# Altium project Yukitora.PrjPcb (part 3 of 5)

## Sheet Levels.SchDoc
size Tabloid
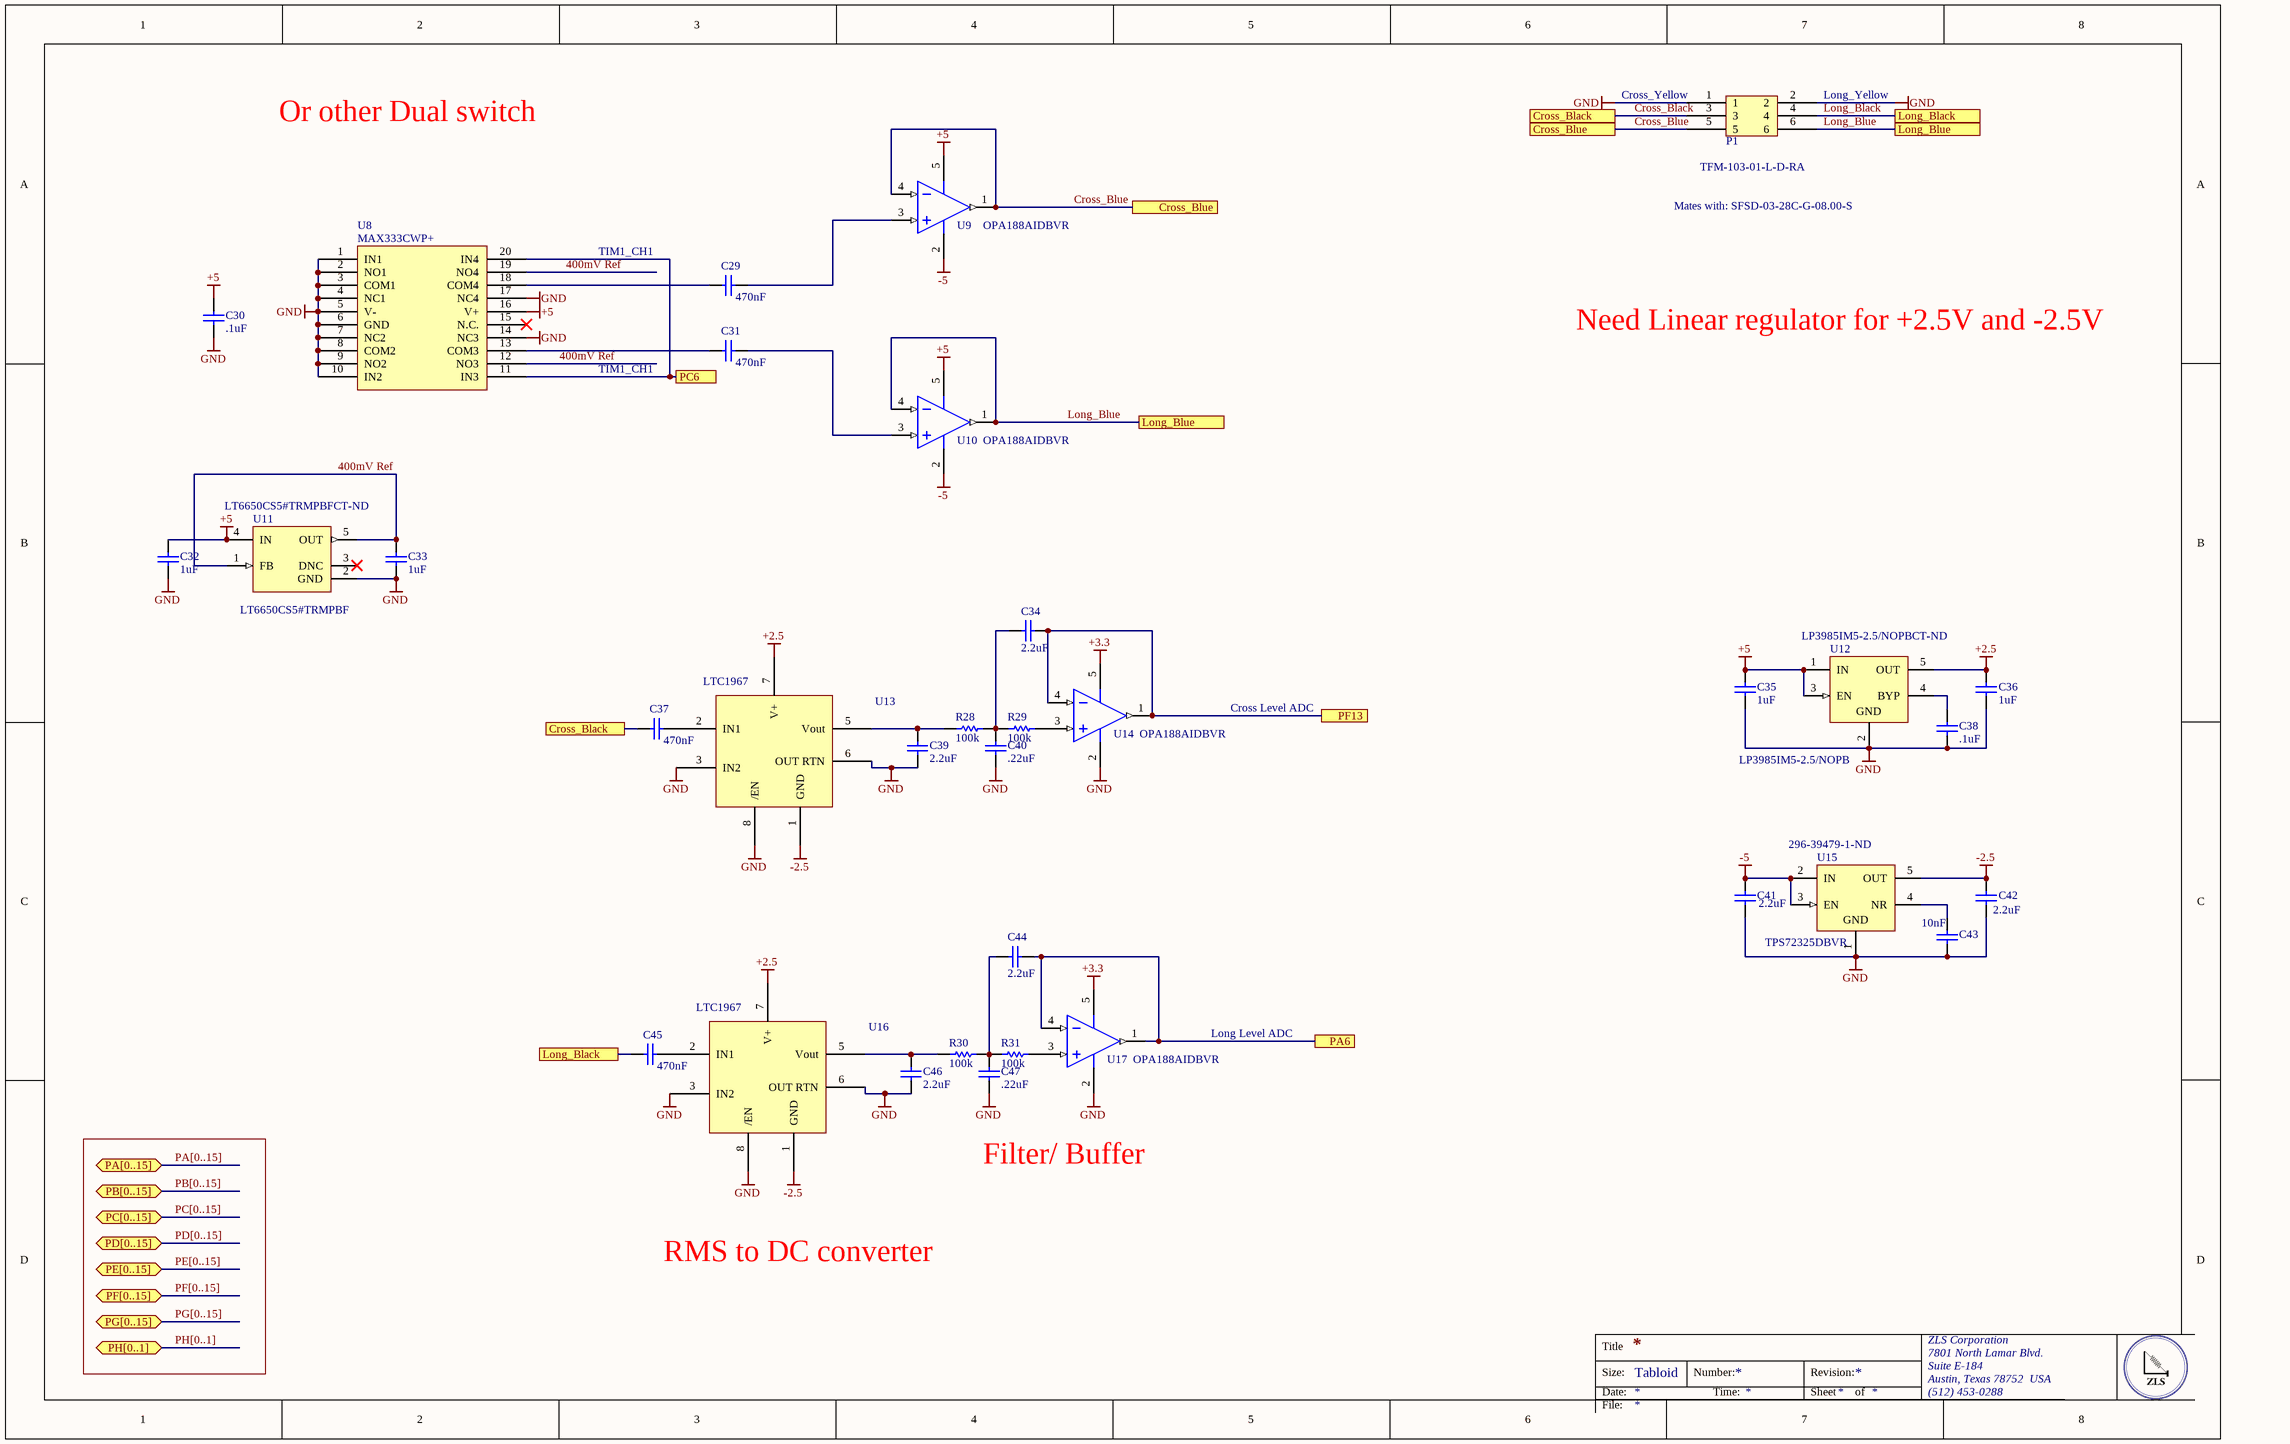
[diagram p6: Levels.SchDoc]

### Parts
C29  470nF  [CAPC0805(2012)75_L]
C30  .1uF  [CAPC0805(2012)75_L]
C31  470nF  [CAPC0805(2012)75_L]
C32  Capacitance: 1uF  [CAPC0805(2012)145_N]  (hidden comment: 08053C105JAT2A)
C33  Capacitance: 1uF  [CAPC0805(2012)145_N]  (hidden comment: 08053C105JAT2A)
C34  2.2uF  [CAPC0805(2012)75_L]
C35  Capacitance: 1uF  [CAPC0805(2012)145_N]  (hidden comment: 08053C105JAT2A)
C36  Capacitance: 1uF  [CAPC0805(2012)145_N]  (hidden comment: 08053C105JAT2A)
C37  470nF  [CAPC0805(2012)75_L]
C38  .1uF  [CAPC0805(2012)75_L]
C39  2.2uF  [CAPC0805(2012)75_L]
C40  .22uF  [CAPC0805(2012)75_L]
C41  Capacitance: 2.2uF  [CAPC2013X135X50ML10T20]  (hidden comment: GRM21BR71A225KA01L)
C42  Capacitance: 2.2uF  [CAPC2013X135X50ML10T20]  (hidden comment: GRM21BR71A225KA01L)
C43  Capacitance: 10nF  [CAPC2013X140X50NL20T25]  (hidden comment: 0805ZC103KAT2A)
C44  2.2uF  [CAPC0805(2012)75_L]
C45  470nF  [CAPC0805(2012)75_L]
C46  2.2uF  [CAPC0805(2012)75_L]
C47  .22uF  [CAPC0805(2012)75_L]
P1  TFM-103-01-L-D-RA  [TFM-103-01-L-D-RA]
R28  100k  [RESC0805(2012)_L]
R29  100k  [RESC0805(2012)_L]
R30  100k  [RESC0805(2012)_L]
R31  100k  [RESC0805(2012)_L]
U8  MAX333CWP+  [TSOP65P640X90-20N]
U9  OPA188AIDBVR  [DBV0005A_M]
U10  OPA188AIDBVR  [DBV0005A_M]
U11  LT6650CS5#TRMPBF  Supplier Part Number 1: LT6650CS5#TRMPBFCT-ND  [LT-S5-5-TSOT-23_N]
U12  LP3985IM5-2.5/NOPB  Supplier Part Number 1: LP3985IM5-2.5/NOPBCT-ND  [DBV0005A_M]
U13  LTC1967  [LTC1967]
U14  OPA188AIDBVR  [DBV0005A_M]
U15  TPS72325DBVR  Supplier Part Number 1: 296-39479-1-ND  [DBV0005A_N]
U16  LTC1967  [LTC1967]
U17  OPA188AIDBVR  [DBV0005A_M]

### Ports
Cross_Black, Cross_Blue, Long_Black, Long_Blue, PA6, PA[0..15] (bidir), PB[0..15] (bidir), PC6, PC[0..15] (bidir), PD[0..15] (bidir), PE[0..15] (bidir), PF13, PF[0..15] (bidir), PG[0..15] (bidir), PH[0..1] (bidir)

### Nets
+2.5: C36.2 U12.5(OUT) U13.7(V+) U16.7(V+)
+3.3: U14.5(V+) U17.5(V+)
+5: C30.2 C32.2 C35.2 U8.16(V+) U9.5(V+) U10.5(V+) U11.4(IN) U12.1(IN) U12.3(EN)
-2.5: C42.2 U13.1(GND) U15.5(OUT) U16.1(GND)
-5: C41.2 U9.2(V-) U10.2(V-) U15.2(IN) U15.3(EN)
GND: C30.1 C32.1 C33.1 C35.1 C36.1 C38.1 C39.1 C40.1 C41.1 C42.1 C43.1 C46.1 C47.1 P1.1 P1.2 U8.1(IN1) U8.2(NO1) U8.3(COM1) U8.4(NC1) U8.5(V-) U8.6(GND) U8.7(NC2) U8.8(COM2) U8.9(NO2) U8.10(IN2) U8.14(NC3) U8.17(NC4) U11.2(GND) U12.2(GND) U13.3(IN2) U13.6(OUT_RTN) U13.8(/EN) U14.2(V-) U15.1(GND) U16.3(IN2) U16.6(OUT_RTN) U16.8(/EN) U17.2(V-)
400mV Ref: C33.2 U8.12(NO3) U8.19(NO4) U11.1(FB) U11.5(OUT)
Cross_Black: C37.1 P1.3 ; port Cross_Black
Cross_Blue: P1.5 U9.1(OUT) U9.4(IN-) ; port Cross_Blue
Long_Black: C45.1 P1.4 ; port Long_Black
Long_Blue: P1.6 U10.1(OUT) U10.4(IN-) ; port Long_Blue
PA6: C44.1 U17.1(OUT) U17.4(IN-) ; port PA6
PC6: U8.11(IN3) U8.20(IN4) ; port PC6
PF13: C34.1 U14.1(OUT) U14.4(IN-) ; port PF13
NetC29_1: C29.1 U8.18(COM4)
NetC29_2: C29.2 U9.3(IN+)
NetC31_1: C31.1 U8.13(COM3)
NetC31_2: C31.2 U10.3(IN+)
NetC34_2: C34.2 C40.2 R28.1 R29.2
NetC37_2: C37.2 U13.2(IN1)
NetC38_2: C38.2 U12.4(BYP)
NetC39_2: C39.2 R28.2 U13.5(Vout)
NetC43_2: C43.2 U15.4(NR)
NetC44_2: C44.2 C47.2 R30.1 R31.2
NetC45_2: C45.2 U16.2(IN1)
NetC46_2: C46.2 R30.2 U16.5(Vout)
NetR29_1: R29.1 U14.3(IN+)
NetR31_1: R31.1 U17.3(IN+)

Not connected (* = marked no-connect by the designer): U8 15(N.C.)*; U11 3(DNC)*; U13 4(NC); U16 4(NC)

### Buses and harness runs
bus PA[0..15] = port PA[0..15]
bus PB[0..15] = port PB[0..15]
bus PC[0..15] = port PC[0..15]
bus PD[0..15] = port PD[0..15]
bus PE[0..15] = port PE[0..15]
bus PF[0..15] = port PF[0..15]
bus PG[0..15] = port PG[0..15]
bus PH[0..1] = port PH[0..1]

### Notes on the sheet
- Or other Dual switch
- (near P1) Cross_Yellow
- (near P1) Long_Yellow
- Mates with: SFSD-03-28C-G-08.00-S
- TIM1_CH1
- Need Linear regulator for +2.5V and -2.5V
- Cross Level ADC
- Long Level ADC
- Filter/ Buffer
- RMS to DC converter
- Title
- Size:
- Date:
- Tabloid
- Number:
- Time:
- Revision:
- Sheet
- of
- ZLS Corporation
- 7801 North Lamar Blvd.
- Suite E-184
- Austin, Texas 78752  USA
- (512) 453-0288
- File:

### Library data of the parts
C29 C31 C37 C45 = CMP-1036-02117-1: CAP 150pF 16V ±10% 0805 (2012 Metric) Thickness 0.75mm SMD; Case-EIA: 0805; Tolerance: Â±10%; Value: .47uF; Case-Metric: 2012; Technology: SMT; Max Thickness: 0.75 mm; Rated Voltage: 16 V
C30 = CMP-1036-02117-1: CAP 150pF 16V ±10% 0805 (2012 Metric) Thickness 0.75mm SMD; Case-EIA: 0805; Tolerance: Â±10%; Case-Metric: 2012; Technology: SMT; Max Thickness: 0.75 mm; Rated Voltage: 16 V; Value: .1uF
C32 C33 C35 C36 = CMP-1036-04752-1: 1µF ±5% 25V Ceramic Capacitor X7R 0805 (2012 Metric); Manufacturer: Kyocera AVX; Tolerance: Â±5%; Case-Metric: 2012; Case-EIA: 0805; Value: 1uF; Technology: SMT; Rated Voltage: 25 V; Max Thickness: 1.45 mm; Supplier 1: Digi-Key; Supplier Part Number 1: 478-10487-1-ND; Manufacturer Part Number: 08053C105JAT2A; Stock 1: 13701; Pricing 1: 1=0.44000, 10=0.30400, 100=0.18220, 500=0.13662, 1000=0.11537 (USD); RoHS: Yes; Mount: Surface Mount; Case/Package: 0805; Number of Pins: 2; Case Code (Metric): 2012; Case Code (Imperial): 0805; Contact Plating: Tin; Min Operating Temperature: -55°C; Max Operating Temperature: 125°C; Packaging: Tape and Reel; Voltage Rating: 25V; Package Quantity: 2000; Dielectric: X7R; Voltage Rating (DC): 25V; Termination: SMD/SMT; Length: 2.01mm; Height: 1.4mm; Width: 0.049inch; Thickness: 0.037inch; Depth: 1.25mm; Radiation Hardening: No; Lead Free: Lead Free; REACH SVHC: Unknown; ComponentLink1URL: https://datasheet.ciiva.com/221/cx7r-221690.pdf?src-supplier=Digi-Key; ComponentLink1Description: https://datasheet.ciiva.com/221/cx7r-221690.pdf?src-supplier=Digi-Key; ComponentLink2URL: https://datasheet.ciiva.com/5419/cx7r-218113-5419770.pdf?src-supplier=Mouser; ComponentLink2Description: https://datasheet.ciiva.com/5419/cx7r-218113-5419770.pdf?src-supplier=Mouser; ComponentLink3URL: https://datasheet.ciiva.com/28586/1679506-28586091.pdf?src-supplier=Element14; ComponentLink3Description: https://datasheet.ciiva.com/28586/1679506-28586091.pdf?src-supplier=Element14; ComponentLink4URL: https://datasheet.ciiva.com/11499/cx7r-11499836.pdf?src-supplier=Avnet; ComponentLink4Description: https://datasheet.ciiva.com/11499/cx7r-11499836.pdf?src-supplier=Avnet
C34 C39 C40 C44 C46 C47 = CMP-1036-02117-1: CAP 150pF 16V ±10% 0805 (2012 Metric) Thickness 0.75mm SMD; Case-EIA: 0805; Tolerance: Â±10%; Value: 1uF; Case-Metric: 2012; Technology: SMT; Max Thickness: 0.75 mm; Rated Voltage: 16 V
C38 = CMP-1036-02117-1: 0.1µF ±10% 25V Ceramic Capacitor X7R 0805 (2012 Metric); Manufacturer: Vishay; Manufacturer Part Number: VJ0805Y104KXXCW1BC; Dielectric Material: Tantalum; Capacitance: 100nF; Supplier 1: Digi-Key; Supplier Part Number 1: 720-1537-1-ND; Stock 1: 72674; Pricing 1: 1=0.26000, 10=0.17900, 100=0.10120, 500=0.07142, 1000=0.06250 (USD); RoHS: Yes; Mount: Surface Mount; Case/Package: 0805; Number of Pins: 2; Weight: 0.000194oz; Case Code (Imperial): 0805; Case Code (Metric): 2012; Min Operating Temperature: -55°C; Max Operating Temperature: 125°C; Tolerance: 10%; Packaging: Tape and Reel; Package Quantity: 4000; Voltage Rating: 25V; Dielectric: X7R; Voltage Rating (DC): 25V; Termination: SMD/SMT; Length: 2mm; Height: 1.45mm; Width: 1.25mm; Thickness: 0.037inch; Depth: 1.25mm; Lead Free: Lead Free; ComponentLink1URL: https://datasheet.ciiva.com/11491/vjw1bcbascomseries-11491758.pdf?src-supplier=Avnet; ComponentLink1Description: https://datasheet.ciiva.com/11491/vjw1bcbascomseries-11491758.pdf?src-supplier=Avnet; ComponentLink2URL: https://datasheet.ciiva.com/176/vjw1bcbascomseries-176875.pdf?src-supplier=Digi-Key; ComponentLink2Description: https://datasheet.ciiva.com/176/vjw1bcbascomseries-176875.pdf?src-supplier=Digi-Key
C41 C42 = CMP-2007-03454-1: 2.2µF ±10% 10V Ceramic Capacitor X7R 0805 (2012 Metric); Manufacturer: Murata; Dissipation Factor: 0.035%; Part Number: GRM21BR71A225KA01L; Supplier 1: Digi-Key; Supplier Part Number 1: 490-1696-1-ND; Manufacturer Part Number: GRM21BR71A225KA01L; Stock 1: 271684; Pricing 1: 1=0.27000, 10=0.18600, 100=0.09440, 500=0.06458, 1000=0.05713 (USD); RoHS: Yes; Mount: Surface Mount; Case/Package: 0805; Number of Pins: 2; Case Code (Imperial): 0805; Case Code (Metric): 2012; Min Operating Temperature: -55°C; Max Operating Temperature: 125°C; Tolerance: 10%; Packaging: Tape and Reel; Package Quantity: 1; Voltage Rating: 10V; Dielectric: X7R; Voltage Rating (DC): 10V; Termination: SMD/SMT; Voltage: 10V; Length: 2mm; Height: 1.25mm; Width: 1.25mm; Thickness: 0.053inch; Depth: 1.25mm; Radiation Hardening: No; REACH SVHC: No SVHC; Lead Free: Lead Free; ComponentLink1URL: https://datasheet.ciiva.com/2989/product-2989712.pdf?src-supplier=Avnet; ComponentLink1Description: https://datasheet.ciiva.com/2989/product-2989712.pdf?src-supplier=Avnet; ComponentLink2URL: https://datasheet.ciiva.com/3778/grm21br71a225ka0123-3778504.pdf?src-supplier=Arrow; ComponentLink2Description: https://datasheet.ciiva.com/3778/grm21br71a225ka0123-3778504.pdf?src-supplier=Arrow; ComponentLink3URL: https://datasheet.ciiva.com/11786/0900766b80936815-11786251.pdf?src-supplier=RSComponents; ComponentLink3Description: https://datasheet.ciiva.com/11786/0900766b80936815-11786251.pdf?src-supplier=RSComponents; ComponentLink4URL: https://datasheet.ciiva.com/16203/product-16203815.pdf?src-supplier=Future+Electronics; ComponentLink4Description: https://datasheet.ciiva.com/16203/product-16203815.pdf?src-supplier=Future+Electronics; ComponentLink5URL: https://datasheet.ciiva.com/135/partnumbering-e-01-135064.pdf?src-supplier=Digi-Key; ComponentLink5Description: https://datasheet.ciiva.com/135/partnumbering-e-01-135064.pdf?src-supplier=Digi-Key; ComponentLink6URL: https://datasheet.ciiva.com/135/partnumbering-e-01-135065.pdf?src-supplier=Digi-Key; ComponentLink6Description: https://datasheet.ciiva.com/135/partnumbering-e-01-135065.pdf?src-supplier=Digi-Key; ComponentLink7URL: https://datasheet.ciiva.com/135/partnumbering-e-01-135066.pdf?src-supplier=Digi-Key; ComponentLink7Description: https://datasheet.ciiva.com/135/partnumbering-e-01-135066.pdf?src-supplier=Digi-Key; ComponentLink8URL: https://datasheet.ciiva.com/22703/608985-22703358.pdf?src-supplier=Element14; ComponentLink8Description: https://datasheet.ciiva.com/22703/608985-22703358.pdf?src-supplier=Element14; ComponentLink9URL: https://datasheet.ciiva.com/2989/product-2989711.pdf?src-supplier=Avnet; ComponentLink9Description: https://datasheet.ciiva.com/2989/product-2989711.pdf?src-supplier=Avnet
C43 = CMP-2007-04770-1: 10000pF ±10% 10V Ceramic Capacitor X7R 0805 (2012 Metric); Manufacturer: AVX Interconnect / Elco; Part Number: 0805ZC103KAT2A; Supplier 1: Digi-Key; Supplier Part Number 1: 478-11396-1-ND; Manufacturer Part Number: 0805ZC103KAT2A; Stock 1: 11980; Pricing 1: 1=0.32000, 10=0.21700, 100=0.11010, 500=0.07534, 1000=0.06665 (USD); RoHS: Yes; Mount: Surface Mount; Case/Package: 0805; Number of Pins: 2; Case Code (Metric): 2012; Case Code (Imperial): 0805; Min Operating Temperature: -55°C; Max Operating Temperature: 125°C; Tolerance: 10%; Packaging: Tape and Reel; Termination: SMD/SMT; Package Quantity: 4000; Dielectric: X7R; Voltage Rating (DC): 10V; Voltage Rating: 10V; Length: 2.01mm; Width: 0.049inch; Depth: 1.25mm; Thickness: 0.037inch; Radiation Hardening: No; REACH SVHC: Unknown; ComponentLink1URL: https://datasheet.ciiva.com/205/cx7r-205251.pdf?src-supplier=Digi-Key; ComponentLink1Description: https://datasheet.ciiva.com/205/cx7r-205251.pdf?src-supplier=Digi-Key; ComponentLink2URL: https://datasheet.ciiva.com/11508/cx7r-11508056.pdf?src-supplier=Avnet; ComponentLink2Description: https://datasheet.ciiva.com/11508/cx7r-11508056.pdf?src-supplier=Avnet; ComponentLink3URL: https://datasheet.ciiva.com/17489/cx7r-17489036.pdf?src-supplier=Avnet+Europe; ComponentLink3Description: https://datasheet.ciiva.com/17489/cx7r-17489036.pdf?src-supplier=Avnet+Europe; ComponentLink4URL: https://datasheet.ciiva.com/5420/cx7r-5420079.pdf?src-supplier=Mouser; ComponentLink4Description: https://datasheet.ciiva.com/5420/cx7r-5420079.pdf?src-supplier=Mouser
P1 = TFM-103-01-L-D-RA: Manufacturer: Samtec; System: Connector; Supplier 1: Mouser; Supplier Part Number 1: 200-TFM10301LDRA; Manufacturer Part Number: TFM-103-01-L-D-RA; Stock 1: 202; Pricing 1: 1=2.15000, 10=1.78000, 50=1.78000, 100=1.33000, 1000=0.98500, 10000=0.92500 (USD); RoHS: No
R28-R31 = CMP-1013-00215-1: 2R55 0.125W 1% 0805 (2012 Metric)  SMD; Case-Metric: 2012; Case-EIA: 0805; Value: 100k; Tolerance: 1 %; Technology: SMT; Power: 0.125 W
U8 = MAX333CWP+: IC SWITCH QUAD SPDT 20TSSOP; Manufacturer: Maxim; Manufacturer Part Number: MAX333AEUP+; Max Supply Voltage: 30V; Min Supply Voltage: 10V; Min Dual Supply Voltage: 4.5V; Max Dual Supply Voltage: 20V; On-State Resistance: 35R; Operating Supply Current: 1uA; Supply Type: Single,Dual; Max Power Dissipation: 559mW; Turn-On Delay Time: 175ns; Turn-Off Delay Time: 145ns; Max Supply Current: 250uA; Number of Bits: 4; Dual Supply Voltage: 15V; Supplier 1: Mouser; Supplier Part Number 1: 700-MAX333AEUP; Stock 1: 664; Pricing 1: 1=6.77, 10=6.43, 50=5.8, 100=5.8, 1000=5.62, 10000=5.62 (USD); Case/Package: TSSOP; Number of Pins: 20; Weight: 0.006737oz; Min Operating Temperature: -40°C; Max Operating Temperature: 85°C; Packaging: Rail/Tube; Package Quantity: 74; Throw Configuration: SPDT; Number of Channels: 4; Length: 6.6mm; Height: 0.95mm; Width: 4.5mm; Radiation Hardening: No; Lead Free: Lead Free; REACH SVHC: Unknown; ComponentLink1URL: https://datasheet.ciiva.com/2978/max333a-2978850.pdf; ComponentLink1Description: https://datasheet.ciiva.com/2978/max333a-2978850.pdf; ComponentLink2URL: https://datasheet.ciiva.com/30478/0900766b81253c85-30478260.pdf; ComponentLink2Description: https://datasheet.ciiva.com/30478/0900766b81253c85-30478260.pdf; ComponentLink3URL: https://datasheet.ciiva.com/1674/max333a-1674617.pdf; ComponentLink3Description: https://datasheet.ciiva.com/1674/max333a-1674617.pdf; ComponentLink4URL: https://datasheet.ciiva.com/26825/max333aeup-26825546.pdf; ComponentLink4Description: https://datasheet.ciiva.com/26825/max333aeup-26825546.pdf
U9 U10 U14 U17 = CMP-0809-00005-2: Precision, Low Noise, Rail-to-Rail Output, Zero-Drift Operational Amplifier, 4 to 36 V, -40 to 125 degC, 5-pin SOT23 (DBV5), Green (RoHS & no Sb/Br); Manufacturer: Texas Instruments; Total Supply Voltage(Min)(+5V is 5, +/-5V is 10): 4; Offset Drift(Typ)(uV/C): 0.03; Rating: Catalog; SubFamily: Zero Drift Precision Amplifier; GBW(Typ)(MHz): 2; Slew Rate(Typ)(V/us): 0.8; Number of Channels: 1; CMRR(Min)(dB): 120; Iq per channel(Max)(mA): 0.51; Total Supply Voltage(Max)(+5V is 5, +/-5V is 10): 36; PartNumber: OPA188AIDBVR; ComponentLink2Description: Datasheet; ComponentLink2URL: http://www.ti.com/lit/ds/symlink/opa188.pdf; ComponentLink1Description: Manufacturer URL; Mounting Technology: Surface Mount; Eco-Plan: Green (RoHS & no Sb/Br); ComponentLink1URL: http://www.ti.com/; PackageVersion: 4073253-4/K, 03/2006; DatasheetVersion: SBOS642A; ComponentLink3Description: Package Specification; PackageReference: DBV0005A; ComponentLink3URL: http://www.ti.com/litv/pdf/mpds018i; PackageDescription: 5-Pin Plastic Small Outline, Body 1.6 x 2.9 mm, Pitch 0.95 mm; Code_JEDEC: MO-178
U11 = CMP-1567-00007-1: Micropower, 400 mV Reference with Rail-to-Rail Buffer Amplifier, 1.4 to 18 V, 0 to 70 degC, 5-Pin SOT-23 (S5), RoHS, Tape and Reel; Manufacturer: Analog Devices / Linear Technology; VIN Max: 18 V; VIN Min: 1.4 V; Number of Channels: 1; Tolerance: 0.75%; Max Input Voltage: 18V; Min Input Voltage: 1.4V; Output Voltage: 400mV; Temperature Coefficient: 30ppm/°C; Quiescent Current: 15uA; Output Current: 200uA; Reference Type: Series; PackageVersion: Rev. B, 06/2010; ComponentLink1Description: Manufacturer URL; Mounting Technology: Surface Mount; PartNumber: LT6650CS5#TRMPBF; Packing: Tape and Reel; PackageDescription: 5-Pin Plastic Thin Small Out-Line Transistor, Body 1.63 x 2.90 mm, Pitch 0.95 mm; Code_JEDEC: MO-193; Temperature Max: 70 degC; ComponentLink2Description: Datasheet; ComponentLink2URL: http://cds.linear.com/docs/en/datasheet/6650fa.pdf; ComponentLink3URL: http://cds.linear.com/docs/en/packaging/SOT_5_05-08-1635.pdf; ComponentLink1URL: http://www.linear.com/; RoHS: TRUE; ComponentLink3Description: Package Specification; Temperature Min: 0 degC; Supplier 1: Digi-Key; Manufacturer Part Number: LT6650CS5#TRMPBF; Stock 1: 3771; Pricing 1: 1=3.18000, 25=2.11040, 100=1.74480, 250=1.65756 (USD); Case/Package: SOT-23-5; Number of Pins: 5; Min Operating Temperature: 0°C; Max Operating Temperature: 70°C; Package Quantity: 1; Packaging: Tape and Reel; Length: 2.9mm; Height: 0.9mm; Width: 1.75mm; Lead Free: Lead Free; ComponentLink4URL: https://datasheet.ciiva.com/6594/1196-6594366.pdf?src-supplier=Digi-Key; ComponentLink4Description: https://datasheet.ciiva.com/6594/1196-6594366.pdf?src-supplier=Digi-Key; ComponentLink5URL: https://datasheet.ciiva.com/48694/001256472-da-01-en-ic-vref-s-lt6650cs5-trmpbf-tsot-23-5-ltc-48694695.pdf?src-supplier=Conrad; ComponentLink5Description: https://datasheet.ciiva.com/48694/001256472-da-01-en-ic-vref-s-lt6650cs5-trmpbf-tsot-23-5-ltc-48694695.pdf?src-supplier=Conrad
U12 = CMP-0062-01907-3: Micropower, 150mA Low-Noise Ultra Low-Dropout CMOS Voltage Regulator, 5-pin SOT-23, Pb-Free; Manufacturer: Texas Instruments; PackageTopMarking: LCSB*XTT; PowerWise: N; CompType: LDO IC; Max Input Voltage: 6V; Output Voltage: 2.5V; Number of Outputs: 1; Max Power Dissipation: 250mW; Polarity: Positive; Quiescent Current: 150uA; Accuracy: 2%; Output Type: Fixed; Dropout Voltage: 60mV; Current Rating: 150A; ComponentLink1Description: Datasheet URL; PinCount: 5; RoHS: Y; PackageDescription: Molded SOT-23, .115 x .063 x .040 in Body, 5 Lead, .0375 in Pitch; ComponentLink1URL: http://www.ti.com/general/docs/lit/getliterature.tsp?genericPartNumber=LP3985&fileType=pdf; PackageReference: DBV0005A; Supplier 1: Digi-Key; Manufacturer Part Number: LP3985IM5-2.5/NOPB; Stock 1: 16680; Pricing 1: 1=0.66000, 10=0.57800, 100=0.44300, 500=0.35020 (USD); Mount: Surface Mount; Case/Package: SOT-23; Number of Pins: 5; Contact Plating: Tin; Min Operating Temperature: -40°C; Max Operating Temperature: 125°C; Max Output Current: 150mA; Min Input Voltage: 2.5V; Output Current: 150mA; Packaging: Tape and Reel; Power Dissipation: 250mW; Output Voltage Accuracy: 2%; Nominal Output Voltage: 2.5V; Termination: SMD/SMT; Max Supply Voltage: 6V; Min Supply Voltage: 2.5V; Max Output Voltage: 2.5V; Length: 2.92mm; Height: 1.02mm; Width: 1.6mm; Lead Free: Lead Free; REACH SVHC: No SVHC; ComponentLink2URL: https://datasheet.ciiva.com/46441/10171-46441111.pdf?src-supplier=Element14; ComponentLink2Description: https://datasheet.ciiva.com/46441/10171-46441111.pdf?src-supplier=Element14; ComponentLink3URL: https://datasheet.ciiva.com/49047/1882660-49047100.pdf?src-supplier=Element14; ComponentLink3Description: https://datasheet.ciiva.com/49047/1882660-49047100.pdf?src-supplier=Element14; ComponentLink4URL: https://datasheet.ciiva.com/46383/1882660-46383391.pdf?src-supplier=Element14; ComponentLink4Description: https://datasheet.ciiva.com/46383/1882660-46383391.pdf?src-supplier=Element14
U13 U16 = LTC1967: IC CONVERTER RMS-DC PREC 9MSOP
U15 = CMP-0394-00292-2: Single Output High PSRR LDO, 200 mA, Fixed -2.5 V Output, -10 to -2.7 V Input, 5-pin SOT-23 (DBV), -40 to 125 degC, Green (RoHS & no Sb/Br); Manufacturer: Texas Instruments; Iout(Max)(A): 0.2; Iq(Typ)(mA): 0.13; Accuracy(%): 2; Vdo(Typ)(mV): 280; SubFamily: Single Channel LDO; Number of Outputs: 1; Output Voltage: -2.5V; Max Power Dissipation: 560mW; Dropout Voltage: 280mV; Output Current: 200mA; Max Input Voltage: -2.7V; Min Input Voltage: -10V; Min Current Limit: 300mA; Input Bias Current: 130uA; Polarity: Negative; Output Voltage Accuracy: 1%; Accuracy: 2%; Vin(Max)(V): -2.7; PartNumber: TPS72325DBVR; PackageReference: DBV0005A; ComponentLink3Description: Package Specification; Fixed Output Options(V): -2.5; ComponentLink1URL: http://www.ti.com/; ComponentLink1Description: Manufacturer URL; Mounting Technology: Surface Mount; PackageDescription: 5-Pin Plastic Small Outline, Body 1.60 Ãƒâ€” 2.90 mm, Pitch 0.95 mm; ComponentLink2URL: http://www.ti.com/general/docs/lit/getliterature.tsp?genericPartNumber=TPS72325&fileType=pdf; PackageVersion: 4073253-4/K; ComponentLink3URL: http://www.ti.com/litv/pdf/mpds018i; Vout Adj(Min)(V): -2.5; ComponentLink2Description: Datasheet; Vout Adj(Max)(V): -2.5; Eco-Plan: Green (RoHS & no Sb/Br); DatasheetVersion: SLVS346B; Vin(Min)(V): -10; Code_JEDEC: MO-178; Supplier 1: Digi-Key; Manufacturer Part Number: TPS72325DBVR; Stock 1: 6951; Pricing 1: 1=2.81000, 10=2.52200, 100=2.02720, 500=1.66552, 1000=1.37999 (USD); RoHS: Yes; Case/Package: SOT-23; Number of Pins: 5; Contact Plating: Tin; Min Operating Temperature: -40°C; Max Operating Temperature: 125°C; Packaging: Tape and Reel; Package Quantity: 3000; Max Output Current: 200mA; Number of Regulators: 1; Power Dissipation: 560mW; Min Output Voltage: -2.5V; Quiescent Current: 130uA; Max Output Voltage: -2.5V; Output Type: Fixed; Nominal Output Voltage: -2.5V; Radiation Hardening: No; Lead Free: Lead Free; REACH SVHC: No SVHC; ComponentLink4URL: http://www.mouser.com/ds/2/405/slvs346c-521947.pdf?src-supplier=Mouser; ComponentLink4Description: http://www.mouser.com/ds/2/405/slvs346c-521947.pdf?src-supplier=Mouser; ComponentLink5URL: http://components.arrow.com/part/dataview/0323_00141856?src-supplier=Arrow+Europe; ComponentLink5Description: http://components.arrow.com/part/dataview/0323_00141856?src-supplier=Arrow+Europe; ComponentLink6URL: http://www.ti.com/general/docs/lit/getliterature.tsp?genericPartNumber=TPS723&amp;&amp;fileType=pdf&src-supplier=Newark; ComponentLink6Description: http://www.ti.com/general/docs/lit/getliterature.tsp?genericPartNumber=TPS723&amp;&amp;fileType=pdf&src-supplier=Newark; ComponentLink7URL: http://focus.ti.com/lit/ds/symlink/tps72325.pdf?src-supplier=Avnet+Europe; ComponentLink7Description: http://focus.ti.com/lit/ds/symlink/tps72325.pdf?src-supplier=Avnet+Europe; ComponentLink8URL: http://www.ti.com/general/docs/lit/getliterature.tsp?genericPartNumber=TPS723&amp;&amp;fileType=pdf&src-supplier=Farnell; ComponentLink8Description: http://www.ti.com/general/docs/lit/getliterature.tsp?genericPartNumber=TPS723&amp;&amp;fileType=pdf&src-supplier=Farnell; ComponentLink9URL: http://www.ti.com/general/docs/lit/getliterature.tsp?genericPartNumber=TPS723&&fileType=pdf&src-supplier=Avnet+Asia; ComponentLink9Description: http://www.ti.com/general/docs/lit/getliterature.tsp?genericPartNumber=TPS723&&fileType=pdf&src-supplier=Avnet+Asia; ComponentLink10URL: http://www.ti.com/general/docs/lit/getliterature.tsp?genericPartNumber=TPS723&&fileType=pdf&src-supplier=Avnet; ComponentLink10Description: http://www.ti.com/general/docs/lit/getliterature.tsp?genericPartNumber=TPS723&&fileType=pdf&src-supplier=Avnet; ComponentLink11URL: http://components.arrow.com/part/dataview/40177093S9611537N7713?src-supplier=Arrow; ComponentLink11Description: http://components.arrow.com/part/dataview/40177093S9611537N7713?src-supplier=Arrow; ComponentLink12URL: http://www.ti.com/lit/ds/symlink/tps723.pdf?src-supplier=Digi-Key; ComponentLink12Description: http://www.ti.com/lit/ds/symlink/tps723.pdf?src-supplier=Digi-Key; ComponentLink13URL: http://www.ti.com/general/docs/lit/getliterature.tsp?genericPartNumber=TPS723&&fileType=pdf&src-supplier=Element14; ComponentLink13Description: http://www.ti.com/general/docs/lit/getliterature.tsp?genericPartNumber=TPS723&&fileType=pdf&src-supplier=Element14; ComponentLink14URL: http://www.ti.com/lit/ds/symlink/tps72301.pdf?src-supplier=Digi-Key; ComponentLink14Description: http://www.ti.com/lit/ds/symlink/tps72301.pdf?src-supplier=Digi-Key

## Sheet 12V_Supply.SchDoc
size Tabloid; Organization: Altium Limited; Address1: L3, 12a Rodborough Rd; Address2: Frenchs Forest; Address3: NSW; Address4: Australia 2086
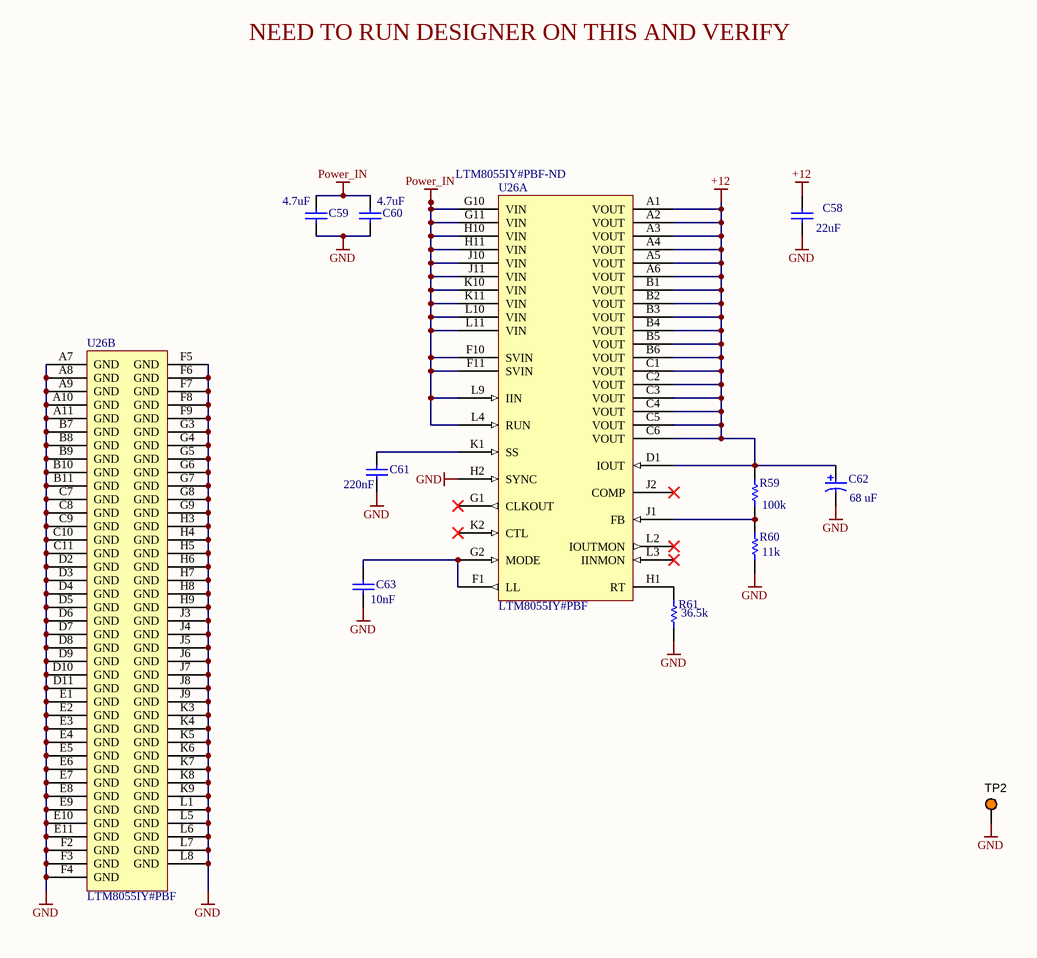
[diagram p7: 12V_Supply.SchDoc]

### Parts
C58  Capacitance: 22uF  [CAPC0805(2012)155_L]  (hidden comment: CAP CER 1UF 25V X7R 0805)
C59  Capacitance: 4.7uF  [CAPC3225X280X50LL20T25]  (hidden comment: C1210C475K5RACTU)
C60  Capacitance: 4.7uF  [CAPC3225X280X50LL20T25]  (hidden comment: C1210C475K5RACTU)
C61  Capacitance: 220nF  [CAPC0402(1005)60_M]  (hidden comment: GRM155R71C224KA12D)
C62  Rated Capacitance: 68 uF  [NIC-CAPA2-6.3X5.8_V]  (hidden comment: UUD1E680MCL1GS)
C63  Capacitance: 10nF  [CAPC1005X56X25NL10T15]  (hidden comment: 0402YC103KAT2A)
R59  Resistance: 100k  [RESC1609X50X30LL10T20]  (hidden comment: CRCW0603100KFKEA)
R60  Resistance: 11k  [RESC1609X50X30ML10T20]  (hidden comment: CRCW060311K0FKEA)
R61  Resistance: 36.5k  [RESC0805(2012)_L]  (hidden comment: CRCW080536K5FKEA)
TP2  5003  [KSTN-5003]  (value not drawn)
U26  LTM8055IY#PBF  Supplier Part Number 1: LTM8055IY#PBF-ND  [LT-BGA-121-15000X15000X4920]  (parts A,B of 2)

### Nets
+12: C58.2 C62.1 R59.2 U26.A1(VOUT) U26.A2(VOUT) U26.A3(VOUT) U26.A4(VOUT) U26.A5(VOUT) U26.A6(VOUT) U26.B1(VOUT) U26.B2(VOUT) U26.B3(VOUT) U26.B4(VOUT) U26.B5(VOUT) U26.B6(VOUT) U26.C1(VOUT) U26.C2(VOUT) U26.C3(VOUT) U26.C4(VOUT) U26.C5(VOUT) U26.C6(VOUT) U26.D1(IOUT)
GND: C58.1 C59.1 C60.1 C61.1 C62.2 C63.1 R60.1 R61.1 TP2.1 U26.A7(GND) U26.A8(GND) U26.A9(GND) U26.A10(GND) U26.A11(GND) U26.B7(GND) U26.B8(GND) U26.B9(GND) U26.B10(GND) U26.B11(GND) U26.C7(GND) U26.C8(GND) U26.C9(GND) U26.C10(GND) U26.C11(GND) U26.D2(GND) U26.D3(GND) U26.D4(GND) U26.D5(GND) U26.D6(GND) U26.D7(GND) U26.D8(GND) U26.D9(GND) U26.D10(GND) U26.D11(GND) U26.E1(GND) U26.E2(GND) U26.E3(GND) U26.E4(GND) U26.E5(GND) U26.E6(GND) U26.E7(GND) U26.E8(GND) U26.E9(GND) U26.E10(GND) U26.E11(GND) U26.F2(GND) U26.F3(GND) U26.F4(GND) U26.F5(GND) U26.F6(GND) U26.F7(GND) U26.F8(GND) U26.F9(GND) U26.G3(GND) U26.G4(GND) U26.G5(GND) U26.G6(GND) U26.G7(GND) U26.G8(GND) U26.G9(GND) U26.H2(SYNC) U26.H3(GND) U26.H4(GND) U26.H5(GND) U26.H6(GND) U26.H7(GND) U26.H8(GND) U26.H9(GND) U26.J3(GND) U26.J4(GND) U26.J5(GND) U26.J6(GND) U26.J7(GND) U26.J8(GND) U26.J9(GND) U26.K3(GND) U26.K4(GND) U26.K5(GND) U26.K6(GND) U26.K7(GND) U26.K8(GND) U26.K9(GND) U26.L1(GND) U26.L5(GND) U26.L6(GND) U26.L7(GND) U26.L8(GND)
Power_IN: C59.2 C60.2 U26.F10(SVIN) U26.F11(SVIN) U26.G10(VIN) U26.G11(VIN) U26.H10(VIN) U26.H11(VIN) U26.J10(VIN) U26.J11(VIN) U26.K10(VIN) U26.K11(VIN) U26.L4(RUN) U26.L9(IIN) U26.L10(VIN) U26.L11(VIN)
NetC61_2: C61.2 U26.K1(SS)
NetC63_2: C63.2 U26.F1(LL) U26.G2(MODE)
NetR59_1: R59.1 R60.2 U26.J1(FB)
NetR61_2: R61.2 U26.H1(RT)

Not connected (* = marked no-connect by the designer): U26 G1(CLKOUT)* J2(COMP)* K2(CTL)* L2(IOUTMON)* L3(IINMON)*

### Notes on the sheet
- NEED TO RUN DESIGNER ON THIS AND VERIFY
- Title
- Size:
- Date:
- Tabloid
- Number:
- Time:
- Revision:
- Sheet
- of
- File:

### Library data of the parts
C58 = CMP-1036-04882-1: 22uF 25V X7R 20% 0805; Manufacturer: Kyocera AVX; Manufacturer Part Number: 08053C105JAT2A; Tolerance: 5%; Supplier 1: Digi-Key; Supplier Part Number 1: 478-10487-1-ND; Stock 1: 13733; Pricing 1: 1=0.44000, 10=0.30400, 100=0.18220, 500=0.13662, 1000=0.11537 (USD); RoHS: Yes; Mount: Surface Mount; Case/Package: 0805; Number of Pins: 2; Case Code (Metric): 2012; Case Code (Imperial): 0805; Contact Plating: Tin; Min Operating Temperature: -55°C; Max Operating Temperature: 125°C; Packaging: Tape and Reel; Voltage Rating: 25V; Package Quantity: 2000; Dielectric: X7R; Voltage Rating (DC): 25V; Termination: SMD/SMT; Length: 2.01mm; Height: 1.4mm; Width: 0.049inch; Thickness: 0.037inch; Depth: 1.25mm; Radiation Hardening: No; REACH SVHC: Unknown; Lead Free: Lead Free; ComponentLink1URL: https://datasheet.ciiva.com/221/cx7r-221690.pdf?src-supplier=Digi-Key; ComponentLink1Description: https://datasheet.ciiva.com/221/cx7r-221690.pdf?src-supplier=Digi-Key; ComponentLink2URL: https://datasheet.ciiva.com/5419/cx7r-218113-5419770.pdf?src-supplier=Mouser; ComponentLink2Description: https://datasheet.ciiva.com/5419/cx7r-218113-5419770.pdf?src-supplier=Mouser; ComponentLink3URL: https://datasheet.ciiva.com/28586/1679506-28586091.pdf?src-supplier=Element14; ComponentLink3Description: https://datasheet.ciiva.com/28586/1679506-28586091.pdf?src-supplier=Element14; ComponentLink4URL: https://datasheet.ciiva.com/11499/cx7r-11499836.pdf?src-supplier=Avnet; ComponentLink4Description: https://datasheet.ciiva.com/11499/cx7r-11499836.pdf?src-supplier=Avnet
C59 C60 = CMP-2000-07550-1: Chip Capacitor, 4.7 uF, +/- 10%, 50 V, -55 to 125 degC, 1210 (3225 Metric), RoHS, Tape and Reel; Manufacturer: Kemet; Voltage Rating (DC): 50V; Dielectric Material: Ceramic; Dielectric: X7R; Case\/Package: 1210; Height: 0.098inch; Datasheet URL: https://search.kemet.com/component-edge/download/datasheet/C1210C475K5RACTU.pdf; Voltage: 50V; Packaging: TapeandReel; Package Reference: 1210; Mounting Technology: SurfaceMount; Package Description: 2-Pin Surface Mount Device, Body 3.2 x 2.5 mm; Manufacturer URL: http://www.kemet.com/; Width: 0.098inch; Voltage Rating: 50V; Package Quantity: 1000; Thickness: 0.11inch; Number of Pins: 2; Case Code (Imperial): 1210; Termination: SMD/SMT; Radiation Hardening: No; Depth: 2.5mm; RoHSCompliant: True; Datasheet Version: 06/2017; Length: 3.2mm; REACH SVHC: NoSVHC; Max Operating Temperature: 125degC; Min Operating Temperature: -55degC; Case Code (Metric): 3225; Mount: SurfaceMount; Tolerance: 10%; Supplier 1: Digi-Key; Supplier Part Number 1: 399-6785-1-ND
C61 = CMP-1034-02089-1: 0.22µF ±10% 16V Ceramic Capacitor X7R 0402 (1005 Metric); Manufacturer: Murata; Value: 220nF; Case-Metric: 1005; Case-EIA: 0402; Tolerance: Â±10%; Technology: SMT; Max Thickness: 0.6 mm; Rated Voltage: 16 V; Supplier 1: Digi-Key; Supplier Part Number 1: 490-5418-1-ND; Manufacturer Part Number: GRM155R71C224KA12D; Stock 1: 353724; Pricing 1: 1=0.14000, 10=0.10100, 100=0.04750, 500=0.03334, 1000=0.02760, 2500=0.02568, 5000=0.02350 (USD); RoHS: Yes; Mount: Surface Mount; Case/Package: 0402; Case Code (Metric): 1005; Case Code (Imperial): 0402; Material: Ceramic; Min Operating Temperature: -55°C; Max Operating Temperature: 125°C; Voltage Rating: 16V; Packaging: Tape and Reel; Package Quantity: 1; Voltage Rating (DC): 16V; Dielectric: X7R; Termination: SMD/SMT; Voltage: 16V; Length: 1mm; Height: 0.5mm; Width: 0.02inch; Thickness: 0.022inch; Depth: 0.5mm; Radiation Hardening: No; Lead Free: Lead Free; REACH SVHC: No SVHC; ComponentLink1URL: https://datasheet.ciiva.com/18184/getdatasheetpartid-347270-18184668.pdf?src-supplier=Verical; ComponentLink1Description: https://datasheet.ciiva.com/18184/getdatasheetpartid-347270-18184668.pdf?src-supplier=Verical; ComponentLink2URL: https://datasheet.ciiva.com/132/product-132672.pdf?src-supplier=Digi-Key; ComponentLink2Description: https://datasheet.ciiva.com/132/product-132672.pdf?src-supplier=Digi-Key; ComponentLink3URL: https://datasheet.ciiva.com/29199/454127-da-01-en-vs-kondensator-0402-29199807.pdf?src-supplier=Conrad; ComponentLink3Description: https://datasheet.ciiva.com/29199/454127-da-01-en-vs-kondensator-0402-29199807.pdf?src-supplier=Conrad; ComponentLink4URL: https://datasheet.ciiva.com/16467/product-16467307.pdf?src-supplier=Future+Electronics; ComponentLink4Description: https://datasheet.ciiva.com/16467/product-16467307.pdf?src-supplier=Future+Electronics; ComponentLink5URL: https://datasheet.ciiva.com/48671/product-48671325.pdf?src-supplier=Avnet; ComponentLink5Description: https://datasheet.ciiva.com/48671/product-48671325.pdf?src-supplier=Avnet; ComponentLink6URL: https://datasheet.ciiva.com/132/partnumbering-e-01-132670.pdf?src-supplier=Digi-Key; ComponentLink6Description: https://datasheet.ciiva.com/132/partnumbering-e-01-132670.pdf?src-supplier=Digi-Key; ComponentLink7URL: https://datasheet.ciiva.com/132/partnumbering-e-01-132671.pdf?src-supplier=Digi-Key; ComponentLink7Description: https://datasheet.ciiva.com/132/partnumbering-e-01-132671.pdf?src-supplier=Digi-Key
C62 = CMP-0687-00036-1: Aluminum Electrolytic Capacitor, UD Series, Low Impedance, 68 uF, 25 V, + / - 20%, -55 to 105 degC, Chip Type, 6.3 x 5.8 mm D x L, Pb-Free, Reel; Manufacturer: Nichicon; Packing: Dia382mm Reel; Rated Voltage: 25 V; Impedance: 0.44 Ohm; Rated Ripple Current (at 100kHz): 230 mA; Endurance Time: 2000 h; Tolerance Rated Capacitance: -20 to 20%; ComponentLink3Description: Package Specification; ComponentLink2Description: Datasheet; Diameter: 6.3 mm; PackageReference: CAPAE-D6.3H5.8; Length: 5.8 mm; ComponentLink3URL: http://products.nichicon.co.jp/en/pdf/XJA043/e-ud.pdf; Mounting Technology: Surface Mount; DatasheetVersion: 08/2012; PackageDescription: 2-Pin Surface Mount Device, Diameter 6.3 mm, Height 5.8 mm, Pitch 5.4 mm; ComponentLink2URL: http://products.nichicon.co.jp/en/pdf/XJA043/e-ud.pdf; PartNumber: UUD1E680MCL1GS; ComponentLink1Description: Manufacturer URL; ComponentLink1URL: http://www.nichicon.co.jp/; RoHS: TRUE; Supplier 1: Digi-Key; Supplier Part Number 1: 493-2275-1-ND
C63 = CMP-2008-02797-1: 10000pF ±10% 16V Ceramic Capacitor X7R 0402 (1005 Metric); Manufacturer: AVX Interconnect / Elco; Insulation Resistance: 100GR; Part Number: 0402YC103KAT2A; Supplier 1: Digi-Key; Supplier Part Number 1: 478-1114-1-ND; Manufacturer Part Number: 0402YC103KAT2A; Stock 1: 3382324; Pricing 1: 1=0.10000, 10=0.03800, 100=0.01690, 500=0.01210, 1000=0.00950, 2500=0.00864, 5000=0.00795 (USD); RoHS: Yes; Mount: Surface Mount; Case/Package: 0402; Case Code (Imperial): 0402; Case Code (Metric): 1005; Contact Plating: Tin; Min Operating Temperature: -55°C; Max Operating Temperature: 125°C; Tolerance: 10%; Voltage Rating: 16V; Voltage Rating (DC): 16V; Packaging: Tape and Reel; Dielectric: X7R; Package Quantity: 1; Termination: SMD/SMT; Voltage: 16V; Length: 1mm; Height: 0.5mm; Width: 0.5mm; Thickness: 0.022inch; Depth: 0.5mm; Radiation Hardening: No; REACH SVHC: No SVHC; Lead Free: Lead Free; ComponentLink1URL: https://datasheet.ciiva.com/11788/0900766b80dc2409-11788541.pdf?src-supplier=RSComponents; ComponentLink1Description: https://datasheet.ciiva.com/11788/0900766b80dc2409-11788541.pdf?src-supplier=RSComponents; ComponentLink2URL: https://datasheet.ciiva.com/1123/319609-1123954.pdf?src-supplier=Element14; ComponentLink2Description: https://datasheet.ciiva.com/1123/319609-1123954.pdf?src-supplier=Element14; ComponentLink3URL: https://datasheet.ciiva.com/1123/319609-1123955.pdf?src-supplier=Element14; ComponentLink3Description: https://datasheet.ciiva.com/1123/319609-1123955.pdf?src-supplier=Element14; ComponentLink4URL: https://datasheet.ciiva.com/14596/70001075-14596855.pdf?src-supplier=Allied+Electronics; ComponentLink4Description: https://datasheet.ciiva.com/14596/70001075-14596855.pdf?src-supplier=Allied+Electronics; ComponentLink5URL: https://datasheet.ciiva.com/2987/cx7r-2987704.pdf?src-supplier=Avnet; ComponentLink5Description: https://datasheet.ciiva.com/2987/cx7r-2987704.pdf?src-supplier=Avnet; ComponentLink6URL: https://datasheet.ciiva.com/22749/683218-22749625.pdf?src-supplier=Element14; ComponentLink6Description: https://datasheet.ciiva.com/22749/683218-22749625.pdf?src-supplier=Element14; ComponentLink7URL: https://datasheet.ciiva.com/16290/cx7r-16290154.pdf?src-supplier=Future+Electronics; ComponentLink7Description: https://datasheet.ciiva.com/16290/cx7r-16290154.pdf?src-supplier=Future+Electronics; ComponentLink8URL: https://datasheet.ciiva.com/7709/683218-7709771.pdf?src-supplier=Element14; ComponentLink8Description: https://datasheet.ciiva.com/7709/683218-7709771.pdf?src-supplier=Element14; ComponentLink9URL: https://datasheet.ciiva.com/15212/getdatasheetpartid-110062-15212107.pdf?src-supplier=Verical; ComponentLink9Description: https://datasheet.ciiva.com/15212/getdatasheetpartid-110062-15212107.pdf?src-supplier=Verical; ComponentLink10URL: https://datasheet.ciiva.com/5417/cx7r-218113-5417068.pdf?src-supplier=Mouser; ComponentLink10Description: https://datasheet.ciiva.com/5417/cx7r-218113-5417068.pdf?src-supplier=Mouser; ComponentLink11URL: https://datasheet.ciiva.com/150/cx7r-150221.pdf?src-supplier=Digi-Key; ComponentLink11Description: https://datasheet.ciiva.com/150/cx7r-150221.pdf?src-supplier=Digi-Key; ComponentLink12URL: https://datasheet.ciiva.com/150/cx7r-150222.pdf?src-supplier=Digi-Key; ComponentLink12Description: https://datasheet.ciiva.com/150/cx7r-150222.pdf?src-supplier=Digi-Key; ComponentLink13URL: https://datasheet.ciiva.com/150/cx7r-150223.pdf?src-supplier=Digi-Key; ComponentLink13Description: https://datasheet.ciiva.com/150/cx7r-150223.pdf?src-supplier=Digi-Key
R59 = CMP-2000-03820-1: 100 kOhms ±1% 0.1W, 1/10W Chip Resistor 0603 (1608 Metric) Automotive AEC-Q200 Thick Film; Manufacturer: Vishay Dale; Manufacturer Part Number: CRCW0603-100KFKEA; Power Rating: 100mW; Temperature Coefficient: 100ppm/°C; Voltage Rating: 75V; Part Number: CRCW0603100KFKEA; Supplier 1: Newark; Supplier Part Number 1: 95AC8750; Stock 1: 0; RoHS: Yes; Case/Package: 0603; Number of Pins: 2; Weight: 7.1E-05oz; Case Code (Metric): 1608; Case Code (Imperial): 0603; Contact Plating: Tin; Min Operating Temperature: -55°C; Max Operating Temperature: 155°C; Packaging: Tape and Reel; Tolerance: 1%; Composition: Thick Film; Termination: SMD/SMT; Voltage Rating (DC): 75V; Number of Terminations: 2; Max Power Dissipation: 100mW; Package Quantity: 10; Military Standard: Not; Features: Automotive AEC-Q200; Length: 1.55mm; Height: 0.45mm; Width: 0.033inch; Depth: 0.85mm; Radiation Hardening: No; Lead Free: Lead Free; REACH SVHC: Unknown; ComponentLink1URL: https://datasheet.ciiva.com/11809/0900766b80d98afc-11809004.pdf?src-supplier=RSComponents; ComponentLink1Description: https://datasheet.ciiva.com/11809/0900766b80d98afc-11809004.pdf?src-supplier=RSComponents; ComponentLink2URL: https://datasheet.ciiva.com/2465/dcrcwe3-2465525.pdf?src-supplier=Digi-Key; ComponentLink2Description: https://datasheet.ciiva.com/2465/dcrcwe3-2465525.pdf?src-supplier=Digi-Key; ComponentLink3URL: https://datasheet.ciiva.com/7777/1697337-7777269.pdf?src-supplier=Element14; ComponentLink3Description: https://datasheet.ciiva.com/7777/1697337-7777269.pdf?src-supplier=Element14; ComponentLink4URL: https://datasheet.ciiva.com/15159/getdatasheetpartid-93113-15159925.pdf?src-supplier=Verical; ComponentLink4Description: https://datasheet.ciiva.com/15159/getdatasheetpartid-93113-15159925.pdf?src-supplier=Verical; ComponentLink5URL: https://datasheet.ciiva.com/46441/1720486-46441605.pdf?src-supplier=Element14; ComponentLink5Description: https://datasheet.ciiva.com/46441/1720486-46441605.pdf?src-supplier=Element14; ComponentLink6URL: https://datasheet.ciiva.com/2465/dcrcwe3-2465526.pdf?src-supplier=Digi-Key; ComponentLink6Description: https://datasheet.ciiva.com/2465/dcrcwe3-2465526.pdf?src-supplier=Digi-Key; ComponentLink7URL: https://datasheet.ciiva.com/2465/dcrcwe3-2465527.pdf?src-supplier=Digi-Key; ComponentLink7Description: https://datasheet.ciiva.com/2465/dcrcwe3-2465527.pdf?src-supplier=Digi-Key; ComponentLink8URL: https://datasheet.ciiva.com/8340/dcrcwe3-8340199.pdf?src-supplier=Avnet; ComponentLink8Description: https://datasheet.ciiva.com/8340/dcrcwe3-8340199.pdf?src-supplier=Avnet; ComponentLink9URL: https://datasheet.ciiva.com/16725/70201119-16725223.pdf?src-supplier=Allied+Electronics; ComponentLink9Description: https://datasheet.ciiva.com/16725/70201119-16725223.pdf?src-supplier=Allied+Electronics; ComponentLink10URL: https://datasheet.ciiva.com/8340/dcrcwe3-8340201.pdf?src-supplier=Avnet; ComponentLink10Description: https://datasheet.ciiva.com/8340/dcrcwe3-8340201.pdf?src-supplier=Avnet; ComponentLink11URL: https://datasheet.ciiva.com/7791/66915-7791994.pdf?src-supplier=Element14; ComponentLink11Description: https://datasheet.ciiva.com/7791/66915-7791994.pdf?src-supplier=Element14; ComponentLink12URL: https://datasheet.ciiva.com/5545/dcrcwe3-109170-5545100.pdf?src-supplier=Mouser; ComponentLink12Description: https://datasheet.ciiva.com/5545/dcrcwe3-109170-5545100.pdf?src-supplier=Mouser; ComponentLink13URL: https://datasheet.ciiva.com/26317/fld-crcw-e3-data-en-26317165.pdf?src-supplier=Distrelec; ComponentLink13Description: https://datasheet.ciiva.com/26317/fld-crcw-e3-data-en-26317165.pdf?src-supplier=Distrelec; ComponentLink14URL: https://datasheet.ciiva.com/16941/dcrcw-16941311.pdf?src-supplier=Avnet+Europe; ComponentLink14Description: https://datasheet.ciiva.com/16941/dcrcw-16941311.pdf?src-supplier=Avnet+Europe
R60 = CMP-2000-03860-1: 11 kOhms ±1% 0.1W, 1/10W Chip Resistor 0603 (1608 Metric) Automotive AEC-Q200 Thick Film; Manufacturer: Vishay Dale; Temperature Coefficient: 100ppm/°C; Max Power Dissipation: 100mW; Voltage Rating (DC): 75V; Part Number: CRCW060311K0FKEA; Supplier 1: Digi-Key; Supplier Part Number 1: 541-11.0KHCT-ND; Manufacturer Part Number: CRCW060311K0FKEA; Stock 1: 29614; Pricing 1: 1=0.10000, 10=0.03600, 100=0.01460, 1000=0.00654, 2500=0.00568 (USD); RoHS: Yes; Mount: Surface Mount; Case/Package: 0603; Number of Pins: 2; Weight: 7.1E-05oz; Case Code (Metric): 1608; Case Code (Imperial): 0603; Contact Plating: Tin; Min Operating Temperature: -55°C; Max Operating Temperature: 155°C; Tolerance: 1%; Packaging: Tape and Reel; Composition: Thick Film; Number of Terminations: 2; Package Quantity: 10; Power Rating: 100mW; Voltage Rating: 75V; Features: Automotive AEC-Q200; Termination: SMD/SMT; Military Standard: Not; Length: 1.55mm; Height: 0.45mm; Width: 0.033inch; Depth: 0.85mm; Radiation Hardening: No; Lead Free: Lead Free; REACH SVHC: Unknown; ComponentLink1URL: https://datasheet.ciiva.com/11809/0900766b80d98afc-11809007.pdf?src-supplier=RSComponents; ComponentLink1Description: https://datasheet.ciiva.com/11809/0900766b80d98afc-11809007.pdf?src-supplier=RSComponents; ComponentLink2URL: https://datasheet.ciiva.com/2466/dcrcwe3-2466048.pdf?src-supplier=Digi-Key; ComponentLink2Description: https://datasheet.ciiva.com/2466/dcrcwe3-2466048.pdf?src-supplier=Digi-Key; ComponentLink3URL: https://datasheet.ciiva.com/7172/1635184-7172998.pdf?src-supplier=Newark; ComponentLink3Description: https://datasheet.ciiva.com/7172/1635184-7172998.pdf?src-supplier=Newark; ComponentLink4URL: https://datasheet.ciiva.com/15159/getdatasheetpartid-67722-15159671.pdf?src-supplier=Verical; ComponentLink4Description: https://datasheet.ciiva.com/15159/getdatasheetpartid-67722-15159671.pdf?src-supplier=Verical; ComponentLink5URL: https://datasheet.ciiva.com/16785/70201119-16785768.pdf?src-supplier=Allied+Electronics; ComponentLink5Description: https://datasheet.ciiva.com/16785/70201119-16785768.pdf?src-supplier=Allied+Electronics; ComponentLink6URL: https://datasheet.ciiva.com/22704/1697337-22704604.pdf?src-supplier=Element14; ComponentLink6Description: https://datasheet.ciiva.com/22704/1697337-22704604.pdf?src-supplier=Element14; ComponentLink7URL: https://datasheet.ciiva.com/7663/1697337-7663869.pdf?src-supplier=Element14; ComponentLink7Description: https://datasheet.ciiva.com/7663/1697337-7663869.pdf?src-supplier=Element14; ComponentLink8URL: https://datasheet.ciiva.com/16758/70201119-16758861.pdf?src-supplier=Allied+Electronics; ComponentLink8Description: https://datasheet.ciiva.com/16758/70201119-16758861.pdf?src-supplier=Allied+Electronics; ComponentLink9URL: https://datasheet.ciiva.com/16885/dcrcwe3-16885213.pdf?src-supplier=Avnet+Europe; ComponentLink9Description: https://datasheet.ciiva.com/16885/dcrcwe3-16885213.pdf?src-supplier=Avnet+Europe; ComponentLink10URL: https://datasheet.ciiva.com/16389/dcrcwe3-16389278.pdf?src-supplier=Future+Electronics; ComponentLink10Description: https://datasheet.ciiva.com/16389/dcrcwe3-16389278.pdf?src-supplier=Future+Electronics; ComponentLink11URL: https://datasheet.ciiva.com/26314/fld-crcw-e3-data-en-26314750.pdf?src-supplier=Distrelec; ComponentLink11Description: https://datasheet.ciiva.com/26314/fld-crcw-e3-data-en-26314750.pdf?src-supplier=Distrelec; ComponentLink12URL: https://datasheet.ciiva.com/2466/dcrcwe3-2466047.pdf?src-supplier=Digi-Key; ComponentLink12Description: https://datasheet.ciiva.com/2466/dcrcwe3-2466047.pdf?src-supplier=Digi-Key; ComponentLink13URL: https://datasheet.ciiva.com/2466/dcrcwe3-2466049.pdf?src-supplier=Digi-Key; ComponentLink13Description: https://datasheet.ciiva.com/2466/dcrcwe3-2466049.pdf?src-supplier=Digi-Key; ComponentLink14URL: https://datasheet.ciiva.com/7663/1697337-7663868.pdf?src-supplier=Element14; ComponentLink14Description: https://datasheet.ciiva.com/7663/1697337-7663868.pdf?src-supplier=Element14; ComponentLink15URL: https://datasheet.ciiva.com/3256/dcrcwe3-3256975.pdf?src-supplier=Avnet; ComponentLink15Description: https://datasheet.ciiva.com/3256/dcrcwe3-3256975.pdf?src-supplier=Avnet; ComponentLink16URL: https://datasheet.ciiva.com/22674/1700796-22674591.pdf?src-supplier=Element14; ComponentLink16Description: https://datasheet.ciiva.com/22674/1700796-22674591.pdf?src-supplier=Element14
R61 = CMP-1013-00686-1: 36.5 kOhms ±1% 0.125W, 1/8W Chip Resistor 0805 (2012 Metric) Automotive AEC-Q200 Thick Film; Manufacturer: Vishay; Value: 36500.00 Ohm; Case-EIA: 0805; Case-Metric: 2012; Temperature Coefficient: 100ppm/°C; Power Rating: 125mW; Voltage Rating: 150V; Power: 0.125 W; Tolerance: 1 %; Technology: SMT; Supplier 1: Digi-Key; Supplier Part Number 1: 541-36.5KCCT-ND; Manufacturer Part Number: CRCW080536K5FKEA; Stock 1: 48910; Pricing 1: 1=0.10000, 10=0.06600, 100=0.02670, 1000=0.01199, 2500=0.01041 (USD); RoHS: Yes; Case/Package: 0805; Number of Pins: 2; Weight: 0.000194oz; Case Code (Imperial): 0805; Case Code (Metric): 2012; Contact Plating: Tin; Min Operating Temperature: -55°C; Max Operating Temperature: 155°C; Composition: Thick Film; Packaging: Tape and Reel; Package Quantity: 10; Number of Terminations: 2; Termination: SMD/SMT; Max Power Dissipation: 125mW; Military Standard: Not; Features: Automotive AEC-Q200; Length: 2mm; Height: 0.45mm; Width: 1.25mm; Depth: 1.25mm; Radiation Hardening: No; REACH SVHC: Unknown; ComponentLink1URL: https://datasheet.ciiva.com/11810/0900766b80d98b26-11810705.pdf?src-supplier=RSComponents; ComponentLink1Description: https://datasheet.ciiva.com/11810/0900766b80d98b26-11810705.pdf?src-supplier=RSComponents; ComponentLink2URL: https://datasheet.ciiva.com/6158/1697337-6158553.pdf?src-supplier=Farnell; ComponentLink2Description: https://datasheet.ciiva.com/6158/1697337-6158553.pdf?src-supplier=Farnell; ComponentLink3URL: https://datasheet.ciiva.com/17180/dcrcwe3-17180207.pdf?src-supplier=Avnet+Europe; ComponentLink3Description: https://datasheet.ciiva.com/17180/dcrcwe3-17180207.pdf?src-supplier=Avnet+Europe; ComponentLink4URL: https://datasheet.ciiva.com/15159/getdatasheetpartid-32738-15159319.pdf?src-supplier=Verical; ComponentLink4Description: https://datasheet.ciiva.com/15159/getdatasheetpartid-32738-15159319.pdf?src-supplier=Verical; ComponentLink5URL: https://datasheet.ciiva.com/9013/dcrcwe3-9013306.pdf?src-supplier=Avnet; ComponentLink5Description: https://datasheet.ciiva.com/9013/dcrcwe3-9013306.pdf?src-supplier=Avnet; ComponentLink6URL: https://datasheet.ciiva.com/7671/1697337-7671692.pdf?src-supplier=Element14; ComponentLink6Description: https://datasheet.ciiva.com/7671/1697337-7671692.pdf?src-supplier=Element14; ComponentLink7URL: https://datasheet.ciiva.com/16781/70201119-16781068.pdf?src-supplier=Allied+Electronics; ComponentLink7Description: https://datasheet.ciiva.com/16781/70201119-16781068.pdf?src-supplier=Allied+Electronics; ComponentLink8URL: https://datasheet.ciiva.com/2514/dcrcwe3-2514301.pdf?src-supplier=Digi-Key; ComponentLink8Description: https://datasheet.ciiva.com/2514/dcrcwe3-2514301.pdf?src-supplier=Digi-Key; ComponentLink9URL: https://datasheet.ciiva.com/7671/1697337-7671693.pdf?src-supplier=Element14; ComponentLink9Description: https://datasheet.ciiva.com/7671/1697337-7671693.pdf?src-supplier=Element14; ComponentLink10URL: https://datasheet.ciiva.com/9013/dcrcwe3-9013309.pdf?src-supplier=Avnet; ComponentLink10Description: https://datasheet.ciiva.com/9013/dcrcwe3-9013309.pdf?src-supplier=Avnet; ComponentLink11URL: https://datasheet.ciiva.com/2514/dcrcwe3-2514302.pdf?src-supplier=Digi-Key; ComponentLink11Description: https://datasheet.ciiva.com/2514/dcrcwe3-2514302.pdf?src-supplier=Digi-Key; ComponentLink12URL: https://datasheet.ciiva.com/2514/dcrcwe3-2514303.pdf?src-supplier=Digi-Key; ComponentLink12Description: https://datasheet.ciiva.com/2514/dcrcwe3-2514303.pdf?src-supplier=Digi-Key
TP2 = CMP-1672-00009-1: Test Point, Orange, 1-Pin THD, RoHS; Peak Reverse Current: 600 uA; Forward Current: 3 A; Max Surge Current: 80 A; Forward Voltage: 1.08 V; Max Operating Temperature: 150 degC; PackageReference: 5003; Pins: 2; ComponentLink2URL: http://keyelco.com/userAssets/file/M65p56.pdf; PackageDescription: 1-Pin Through Hole Device, Dia 2.54 mm; Weight: 0.01 lb; Diameter: 5.3 mm; Mount: Through Hole; Package Quantity: 500; Packaging: Bulk; Min Operating Temperature: -65 degC; ComponentLink1Description: Manufacturer URL; Height: 0.25 inch; ComponentLink1URL: http://www.keyelco.com/; ComponentLink2Description: Datasheet; Width: 0.25 inch; REACH SVHC: No SVHC; RoHSCompliant: true; Radiation Hardening: No; Length: 9.5 mm; DatasheetVersion: Jun-15
U26 = CMP-2000-06615-1: Buck-Boost uModule Regulator, 8.5 A, 5 to 36 V, -40 to 125 degC, 121-Ball BGA, RoHS, Tray; Manufacturer: LinearTechnology; Efficiency: 97.5%; Current - Output (Max): 8.5A; Voltage - Output 1: 1.2~36V; Voltage - Input (Min): 5V; Number of Outputs: 1; Voltage - Input (Max): 36V; Package Version: Rev. A, 11/2012; Voltage - Output 2: -; Package Description: 121-Ball BGA, Body 15 x 15 mm, Pitch 1.27 mm; Package / Case: 121-BGA; Mounting Technology: SurfaceMount; Voltage - Isolation: -; Package URL: http://www.linear.com/docs/41075; Series: µModule®; Package Reference: BGA-121; Power (Watts) - Manufacture Series: -; Operating Temperature: -40°C~125°C; Power (Watts) - Max: -; Applications: ITE(Commercial); Manufacturer URL: http://www.linear.com/; Category: PowerSupplies-BoardMount; Family: DCDCConverters; Features: OTP; Packaging: Tray; Voltage - Output 3: -; Datasheet Version: Rev. A, 01/2016; Datasheet URL: http://cds.linear.com/docs/en/datasheet/8055fa.pdf; Mounting Type: SurfaceMount; Type: Non-IsolatedPoLModule; PartId: 1; Supplier 1: Digi-Key